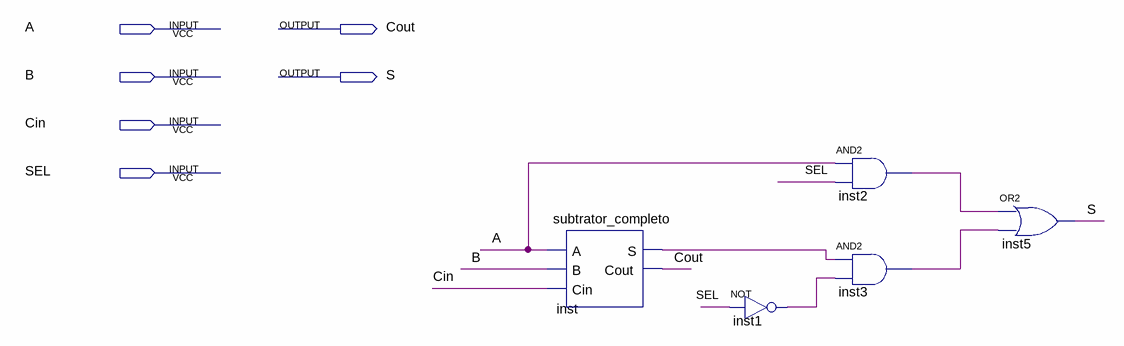
[diagram p0: schematic sheet]
// Quartus schematic bloco_subtrator.bdf as structural Verilog: 5 symbols, 6 pins
module bloco_subtrator (
  input  A,
  input  B,
  input  Cin,
  input  SEL,
  output Cout,
  output S
);

  wire inst1_out, inst2_out, inst3_out, inst_s;

  subtrator_completo inst (.A(A), .B(B), .Cin(Cin), .S(inst_s), .Cout(Cout));
  not inst1 (inst1_out, SEL);
  and inst2 (inst2_out, A, SEL);
  and inst3 (inst3_out, inst_s, inst1_out);
  or inst5 (S, inst2_out, inst3_out);
endmodule
